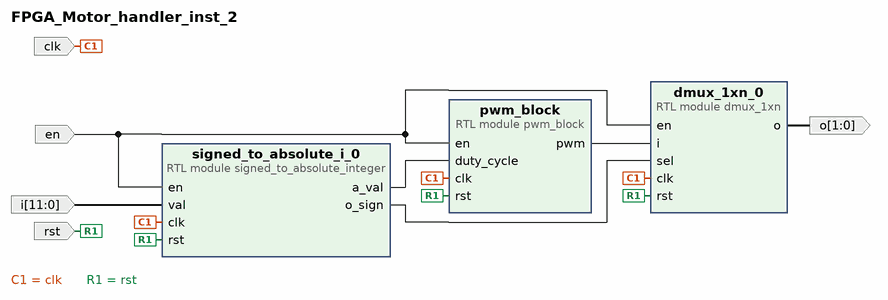
[diagram p0: block diagram of the top level]
# Vivado block design FPGA_Motor_handler_inst_2, xc7z020clg400-1, Vivado 2024.2
create_bd_design FPGA_Motor_handler_inst_2

create_bd_port -dir I -from 11 -to 0 i
create_bd_port -dir I -type clk clk
create_bd_port -dir I -type rst rst
create_bd_port -dir O -from 1 -to 0 o
create_bd_port -dir I en

create_bd_cell -type module -reference pwm_block pwm_block
set_property -dict {CONFIG.max_cnt 1000 CONFIG.n_bits 11} [get_bd_cells pwm_block]
create_bd_cell -type module -reference signed_to_absolute_integer signed_to_absolute_i_0
set_property -dict {CONFIG.n_bits 12} [get_bd_cells signed_to_absolute_i_0]
create_bd_cell -type module -reference dmux_1xn dmux_1xn_0
set_property -dict {CONFIG.n_bits 1} [get_bd_cells dmux_1xn_0]

# ---- connections ----

connect_bd_net -net clk_0_1 [get_bd_ports clk] [get_bd_pins pwm_block/clk] [get_bd_pins signed_to_absolute_i_0/clk] [get_bd_pins dmux_1xn_0/clk]
connect_bd_net [get_bd_pins dmux_1xn_0/o] [get_bd_ports o]
connect_bd_net -net en_0_1 [get_bd_ports en] [get_bd_pins pwm_block/en] [get_bd_pins signed_to_absolute_i_0/en] [get_bd_pins dmux_1xn_0/en]
connect_bd_net [get_bd_ports i] [get_bd_pins signed_to_absolute_i_0/val]
connect_bd_net [get_bd_pins pwm_block/pwm] [get_bd_pins dmux_1xn_0/i]
connect_bd_net -net rst_0_1 [get_bd_ports rst] [get_bd_pins signed_to_absolute_i_0/rst] [get_bd_pins pwm_block/rst] [get_bd_pins dmux_1xn_0/rst]
connect_bd_net [get_bd_pins signed_to_absolute_i_0/a_val] [get_bd_pins pwm_block/duty_cycle]
connect_bd_net [get_bd_pins signed_to_absolute_i_0/o_sign] [get_bd_pins dmux_1xn_0/sel]

validate_bd_design
save_bd_design
